# EAGLE design zmpt101b - 3phase din v0.2 eagle7 (EAGLE 7.7.0)
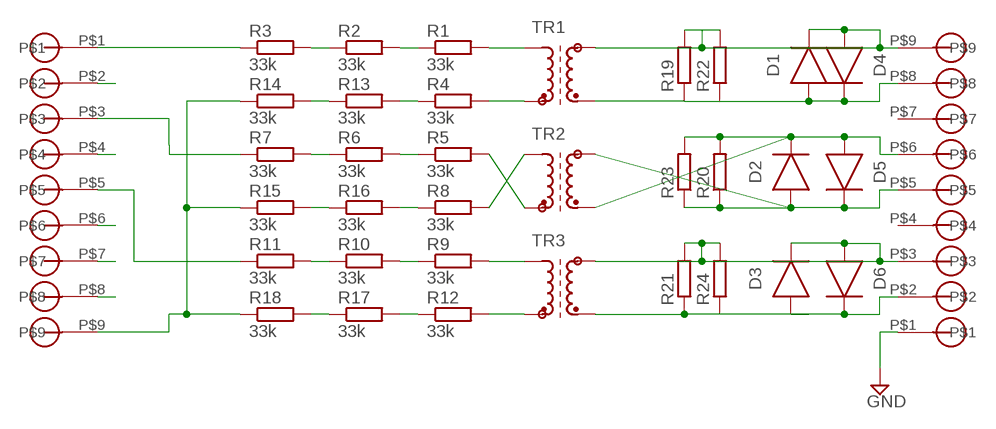
[diagram p0: schematic, sheet 1]

## Parts
D1  DIODE_DO-219-AB(SOD123F)  [SODFL3718X115]
D2  DIODE_DO-219-AB(SOD123F)  [SODFL3718X115]
D3  DIODE_DO-219-AB(SOD123F)  [SODFL3718X115]
D4  DIODE_DO-219-AB(SOD123F)  [SODFL3718X115]
D5  DIODE_DO-219-AB(SOD123F)  [SODFL3718X115]
D6  DIODE_DO-219-AB(SOD123F)  [SODFL3718X115]
R1  33k  R-EU_R0603  [R0603]
R2  33k  R-EU_R0603  [R0603]
R3  33k  R-EU_R0603  [R0603]
R4  33k  R-EU_R0603  [R0603]
R5  33k  R-EU_R0603  [R0603]
R6  33k  R-EU_R0603  [R0603]
R7  33k  R-EU_R0603  [R0603]
R8  33k  R-EU_R0603  [R0603]
R9  33k  R-EU_R0603  [R0603]
R10  33k  R-EU_R0603  [R0603]
R11  33k  R-EU_R0603  [R0603]
R12  33k  R-EU_R0603  [R0603]
R13  33k  R-EU_R0603  [R0603]
R14  33k  R-EU_R0603  [R0603]
R15  33k  R-EU_R0603  [R0603]
R16  33k  R-EU_R0603  [R0603]
R17  33k  R-EU_R0603  [R0603]
R18  33k  R-EU_R0603  [R0603]
R19  110R  R-EU_R0603  [R0603]
R20  110R  R-EU_R0603  [R0603]
R21  110R  R-EU_R0603  [R0603]
R22  R-EU_0207/12  [0207/12]
R23  R-EU_0207/12  [0207/12]
R24  R-EU_0207/12  [0207/12]
TR1  ZMPT101B  [ZMPT101B]
TR2  ZMPT101B  [ZMPT101B]
TR3  ZMPT101B  [ZMPT101B]
U$1  5MMBLOCK_X9  [9/5.08]
U$2  5MMBLOCK_X9  [9/5.08]

## Nets
GND: U$2.P$1
N$1: R3.1 U$1.P$1
N$2: R2.1 R3.2
N$3: R1.1 R2.2
N$4: R1.2 TR1.P$4(A1)
N$5: R4.2 TR1.P$3(E1)
N$6: R14.1 R15.1 R18.1 U$1.P$9
N$7: R7.1 U$1.P$3
N$8: R6.1 R7.2
N$9: R5.1 R6.2
N$10: R8.2 TR2.P$4(A1)
N$11: R5.2 TR2.P$3(E1)
N$12: D3.1(C) D6.2(A) R21.2 R24.2 TR3.P$1(A2) U$2.P$3
N$13: R11.1 U$1.P$5
N$14: R10.1 R11.2
N$15: R9.1 R10.2
N$16: R9.2 TR3.P$4(A1)
N$17: R12.2 TR3.P$3(E1)
N$18: D2.2(A) D5.1(C) R20.1 R23.1 TR2.P$1(A2) U$2.P$5
N$19: D2.1(C) D5.2(A) R20.2 R23.2 TR2.P$2(E2) U$2.P$6
N$20: D1.2(A) D4.1(C) R19.1 R22.1 TR1.P$2(E2) U$2.P$8
N$21: D1.1(C) D4.2(A) R19.2 R22.2 TR1.P$1(A2) U$2.P$9
N$22: U$1.P$2
N$23: U$1.P$4
N$24: U$1.P$7
N$25: U$1.P$6
N$26: U$1.P$8
N$27: D6.1(C) R21.1 R24.1 TR3.P$2(E2) U$2.P$2
N$28: R4.1 R13.2
N$29: R13.1 R14.2
N$30: R8.1 R16.2
N$31: R15.2 R16.1
N$32: R12.1 R17.2
N$33: R17.1 R18.2
N$34: D3.2(A)

## Power pins joined to a net without a drawn wire
P$4: U$2.P$4
P$7: U$2.P$7

## Library data of the parts
D1-D6 = Diode:DIODE: Diode Rectifier - Generic; CATEGORY: Diode; SUB-CATEGORY: Rectifier
R1-R24 = rcl:R-EU_: RESISTOR, European symbol; SPICEPREFIX: R
TR1-TR3 = ZMPT101B:ZMPT101B: TRANSFORMER; OC_FARNELL: unknown; OC_NEWARK: unknown
U$1 U$2 = 5mm terminal block:5MMBLOCK_X9

## Board
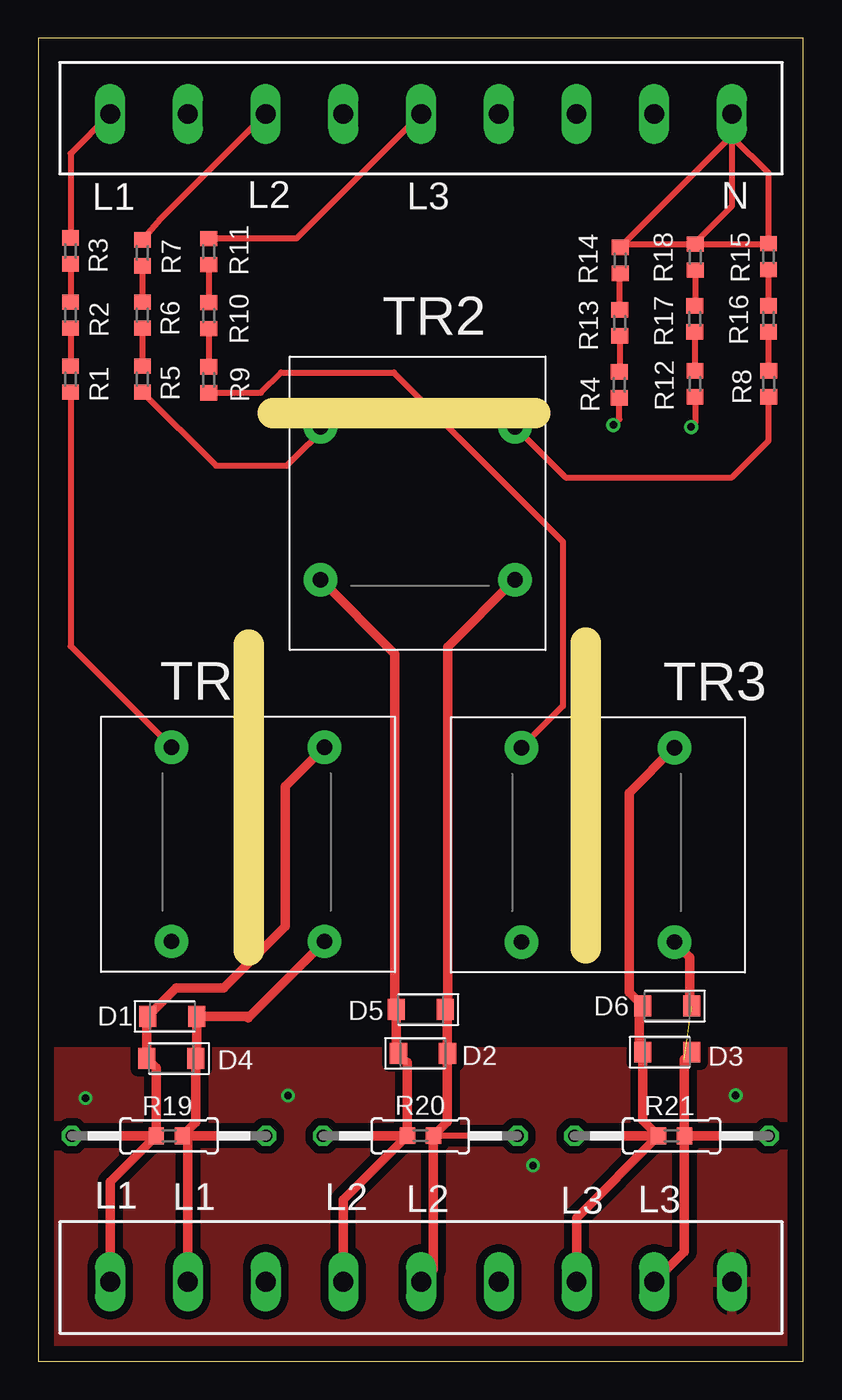
[diagram p1: board, top side]
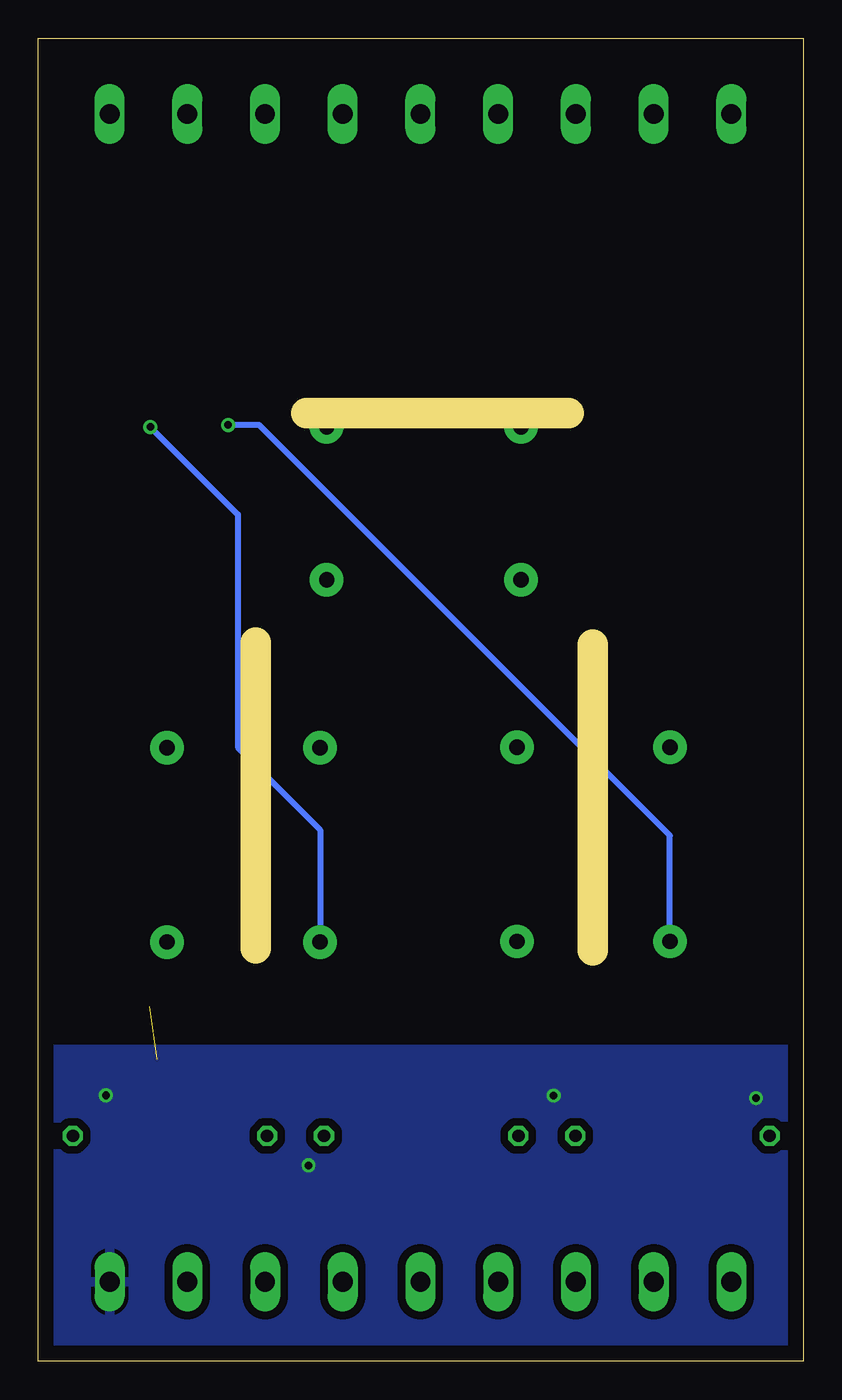
[diagram p2: board, bottom side, seen from below]

Size 50 x 86.5 mm. Coordinates in mm from the lower left corner, seen from the top.
Outline: 0,0 50,0 50,86.5 0,86.5 0,0
Copper layers (1*16): Top 0.035mm / dielectric 0.15mm / Bottom 0.035mm
Design rules "default": minimum track width 6mil, minimum drill 0.35mm, track to track 6mil, track to pad 6mil, pad to pad 6mil, via to via 6mil, smd to smd 6mil, copper to edge 40mil, drill to drill 6mil, minimum pad ring 10mil, minimum via ring 8mil, stop-mask expansion 4mil, vias tented up to drill 0mil, thermal gap 10mil
Milling: 3 lines

### Footprints (pad centres in the part's own frame; a part is rotated, then mirrored left to right if it is on the bottom)
SODFL3718X115 = smd 1.115 x 1.361: 1 -1.6,0; 2 1.6,0
R0603 = smd 1 x 1.1: 1 -0.85,0; 2 0.85,0
0207/12 = drill 0.813 octagon: 1 -6.35,0; 2 6.35,0
ZMPT101B = drill 1 pad 2.184: P$1 14.6,14.7; P$2 14.6,2; P$3 4.6,2; P$4 4.6,14.7
9/5.08 = drill 1.3 long: P$1 -2.54,0; P$2 2.54,0; P$3 7.62,0; P$4 12.7,0; P$5 17.78,0; P$6 22.86,0; P$7 27.94,0; P$8 33.02,0; P$9 38.1,0

### Placement (x,y rotation side)
D1  8.77,22.55 0 top
D2  25.15,20.13 0 top
D3  41.12,20.21 0 top
D4  8.69,19.8 180 top
D5  24.99,23 180 top
D6  41.1,23.23 180 top
R1  2.11,64.21 270 top
R2  2.11,68.4 270 top
R3  2.11,72.59 270 top
R4  37.98,63.84 270 top
R5  6.81,64.21 270 top
R6  6.81,68.4 270 top
R7  6.81,72.46 270 top
R8  47.74,63.91 270 top
R9  11.15,64.17 270 top
R10  11.15,68.36 270 top
R11  11.15,72.55 270 top
R12  42.93,63.91 270 top
R13  38.01,67.9 270 top
R14  38.03,71.98 270 top
R15  47.73,72.22 270 top
R16  47.73,68.15 270 top
R17  42.92,68.15 270 top
R18  42.95,72.18 270 top
R19  8.57,14.74 180 top
R20  24.98,14.75 180 top
R21  41.39,14.74 180 top
R22  8.55,14.74 180 top
R23  24.97,14.74 180 top
R24  41.39,14.74 180 top
TR1  4.11,25.45 0 top
TR2  16.45,65.7 270 top
TR3  26.98,25.41 0 top
U$1  7.24,81.55 0 top
U$2  42.8,5.19 180 top

### Tracks (layer width: path | path; a pad name or v marks a point on that pad's centre or on a via)
GND  (via drill 0.5)
  other vias: 45.58,17.39 16.32,17.37 32.34,12.8 3.09,17.21
  pour Top (isolate 0.508): -5.85,20.23 56.97,20.23 56.97,-6.99 -6.23,-6.99
  pour Bottom (isolate 0.508): -9.3,20.4 55.15,20.4 55.15,-5.32 -10.33,-5.32
N$1
  Top 0.406: U$1.P$1 2.11,78.96 R3.1
N$2
  Top 0.406: R3.2 R2.1
N$3
  Top 0.406: R2.2 R1.1
N$4
  Top 0.406: R1.2 2.11,46.76 TR1.P$4
N$5  (via drill 0.5)
  Top 0.406: v37.59,61.21 37.98,61.6 R4.2
  Bottom 0.406: TR1.P$3 8.71,34.37 35.56,61.21 v37.59,61.21
N$6
  Top 0.406: 45.26,81.47 U$1.P$9 45.34,80.14 | R18.1 38.24,73.03 R14.1 45.34,80.14 | R18.1 43,73.03 47.69,73.03 R15.1 47.73,77.69 45.34,80.07 | R18.1 42.84,73.03 45.34,75.53 45.34,80.07 | 45.34,80.14 45.34,80.07
N$7
  Top 0.406: U$1.P$3 7.99,74.68 R7.1
N$8
  Top 0.406: R7.2 R6.1
N$9
  Top 0.406: R6.2 R5.1
N$10
  Top 0.406: TR2.P$4 34.46,57.78 45.34,57.78 47.74,60.18 R8.2
N$11
  Top 0.406: R5.2 11.62,58.55 16.26,58.55 19.05,61.34 18.7,61.34 TR2.P$3
N$12
  Top 0.406: R24.2 | D6.2 39.27,23 | D3.1 39.27,20.46
  Top 0.61: TR3.P$1 38.61,37.15 38.61,24.11 D6.2 | D3.1 39.52,15.76 R21.2 | U$2.P$3 35.18,9.39 R21.2 | R21.2 R24.2 | 39.27,23 39.27,20.46
N$13
  Top 0.406: U$1.P$5 16.87,73.4 R11.1
N$14
  Top 0.406: R11.2 R10.1
N$15
  Top 0.406: R10.2 R9.1
N$16
  Top 0.406: R9.2 14.55,63.32 15.88,64.64 23.24,64.64 34.29,53.59 34.29,42.83 TR3.P$4
N$17  (via drill 0.5)
  Top 0.406: R12.2 42.93,61.34 v42.67,61.09
  Bottom 0.406: v42.67,61.09 36.96,55.37 36.96,40.13 31.58,34.75 TR3.P$3
N$18
  Top 0.406: 26.76,23.32 26.59,23.15 D5.1 | 25.83,6 U$2.P$5 | R23.1 25.84,14.74 R20.1
  Top 0.61: TR2.P$1 26.76,46.7 26.76,23.32 | 25.83,6 R20.1 26.75,15.67 D2.2 26.75,22.84 D5.1
N$19
  Top 0.406: 23.39,20.29 D2.1 24.13,19.54 | 18.63,14.75 R23.2
  Top 0.61: TR2.P$2 23.31,46.24 23.31,23.35 23.39,23.26 D5.2 23.39,20.29 | U$2.P$6 19.94,10.56 R20.2 | 24.13,19.54 R20.2 | R20.2 18.63,14.75
N$20
  Top 0.406: 13.71,22.55 13.71,22.45 | 10.37,19.87 D4.1 | 9.78,14.38 R19.1
  Top 0.61: TR1.P$2 13.71,22.45 | 13.71,22.55 D1.2 10.37,19.87 | D4.1 10.29,15.62 R19.1 | 9.78,14.38 U$2.P$8 | R22.1 R19.1
N$21
  Top 0.406: R22.2
  Top 0.61: TR1.P$1 16.13,37.57 16.13,28.42 12.12,24.41 9.03,24.41 D1.1 7.09,22.47 D4.2 7.72,19.17 R19.2 | R19.2 4.7,11.72 U$2.P$9 | R19.2 R22.2
N$27  (1 unrouted)
  Top 0.406: 42.72,23.21 D6.1 42.58,23.35 | R21.1
  Top 0.61: 42.24,19.73 R21.1 42.24,7.17 U$2.P$2 | TR3.P$2 42.58,26.41 42.58,23.35 | R24.1 R21.1
N$28
  Top 0.406: R13.2 38.01,64.72 R4.1
N$29
  Top 0.406: R13.1 38.01,71.11 R14.2
N$30
  Top 0.406: R8.1 R16.2
N$31
  Top 0.406: R16.1 R15.2
N$32
  Top 0.406: R17.2 42.92,64.77 R12.1
N$33
  Top 0.406: R18.2 42.95,69.03 R17.1

### Text on the board
tNames: L1 | L2 | L3 | N | L1 | L1 | L2 | L2 | L3 | L3